# Altium schematic sheet Tag.SchDoc
size A4; SheetNumber: 4; SheetTotal: 4
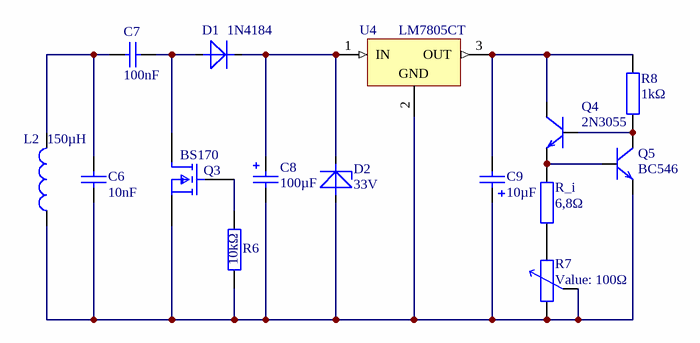
[diagram p0: Tag.SchDoc]

## Parts
C6  value 10nF  [rad-7.2/2.5/5]  (hidden comment: KO)
C7  value 100nF  [rad-7.2/2.5/5]  (hidden comment: KO)
C8  value 100µF  [RB-.1/.2]  (hidden comment: ELKO)
C9  value 10µF  [RB-.1/.2]  (hidden comment: ELKO)
D1  1N4184  [DIODE-0.6]
D2  33V  [DIODE-0.4]
L2  value 150µH  (hidden comment: Inductor)
Q3  BS170  [FP-SOT23-IPC_A]
Q4  2N3055  [TO-92/EBC]
Q5  BC546  [TO-92/EBC]
R6  value 10kΩ  [Axial-0.4]  (hidden comment: RES)
R7  value 100Ω  [PT15]  (hidden comment: POT)
R8  value 1kΩ  [Axial-0.4]  (hidden comment: RES)
R_i  value 6,8Ω  [Axial-0.4]  (hidden comment: RES)
U4  LM7805CT  [FAIR-TO-220-3]

## Nets
NetC6_1: C6.1 C8.2 C9.1 D2.1(A) L2.2 Q3.2(S) Q5.2(E) R6.1 R7.1 R7.3 U4.2(GND)
NetC6_2: C6.2 C7.2 L2.1
NetC7_1: C7.1 D1.1(A) Q3.3(D)
NetC8_1: C8.1 D1.2(K) D2.2(K) U4.1(IN)
NetC9_2: C9.2 Q4.3(C) R8.2 U4.3(OUT)
NetQ3_G1: Q3.G1(G) R6.2
NetQ4_1: Q4.1(B) Q5.3(C) R8.1
NetQ4_2: Q4.2(E) Q5.1(B) R_i.2
NetR7_2: R7.2 R_i.1

## Library data of the parts
C6 C7 = KO: Kondensator
D1 = DIODE
D2 = Z-DIODE
L2 = Inductor: SimulationGenericComponent: True
Q3 = CMP-12801-000064-2: MOSFET N-CH 60V .15MA SOT23-3; On-State Resistance: 5R; Continuous Drain Current (ID): 150mA; Threshold Voltage: 3V; Number of Channels: 1; Gate to Source Voltage (Vgs): 20V; Turn-On Delay Time: 10ns; Power Dissipation: 330mW; Element Configuration: Single; Input Capacitance: 60pF; Weight: 0.000282oz; Height: 1mm; Max Operating Temperature: 150°C; Dual Supply Voltage: 60V; Termination: SMD/SMT; Number of Pins: 3; Number of Elements: 1; Mount: Surface Mount; Min Operating Temperature: -55°C; Nominal Vgs: 3V; Width: 1.4mm; Drain to Source Breakdown Voltage: 60V; Turn-Off Delay Time: 10ns; Case/Package: SOT-23; REACH SVHC: No SVHC; Packaging: Tape and Reel; Length: 3.05mm; Max Power Dissipation: 330mW; Rds On Max: 5R; Lead Free: Lead Free; Contact Plating: Tin; Drain to Source Resistance: 5R; Drain to Source Voltage (Vdss): 60V; Package Quantity: 3000; Current Rating: 150mA; Voltage Rating (DC): 60V
Q4 Q5 = NPN: Transistor
R6 R8 R_i = RES: Widerstand
R7 = POT: Potentiometer; Set Position: 0.5
U4 = CMP-2000-04938-1: Positive Voltage Regulator, 5 V, 1 A, -40 to 125 degC, 3-Pin TO-220, RoHS, Tube; Manufacturer: FairchildSemiconductor; Maximum Input Voltage: 35V; Maximum Quiescent Current: 8mA; Load Regulation: 100mV; Maximum Output Current: 2.2(Typ)A; Output Type: Fixed; Typical Dropout Voltage @ Current: 2@1AV; Rad Hard: No; Output Voltage: 5V; Accuracy: ±4%; Number of Outputs: 1; Category: LinearRegulator; Package Description: 3-Pin Through Hole Device, Body 10 x 4.5 mm, Pitch 2.54 mm; Packaging: Rail/Tube; Mounting: ThroughHole; Polarity: Positive; Manufacturer URL: https://www.fairchildsemi.com/; Line Regulation: 100mV; Datasheet Version: Aug-12; Datasheet URL: https://datasheet.ciiva.com/26904/lm7805ct-26904988.pdf; Package Reference: TO-220; Package URL: https://www.fairchildsemi.com/package-drawings/TO/TO220B03.pdf; Package: 3TO-220AB; Operating Temperature: -40to125degC; Type: Linear